# EAGLE schematic door_lock_v1.2 (EAGLE 9.6.0)

## Sheet 1 of 2
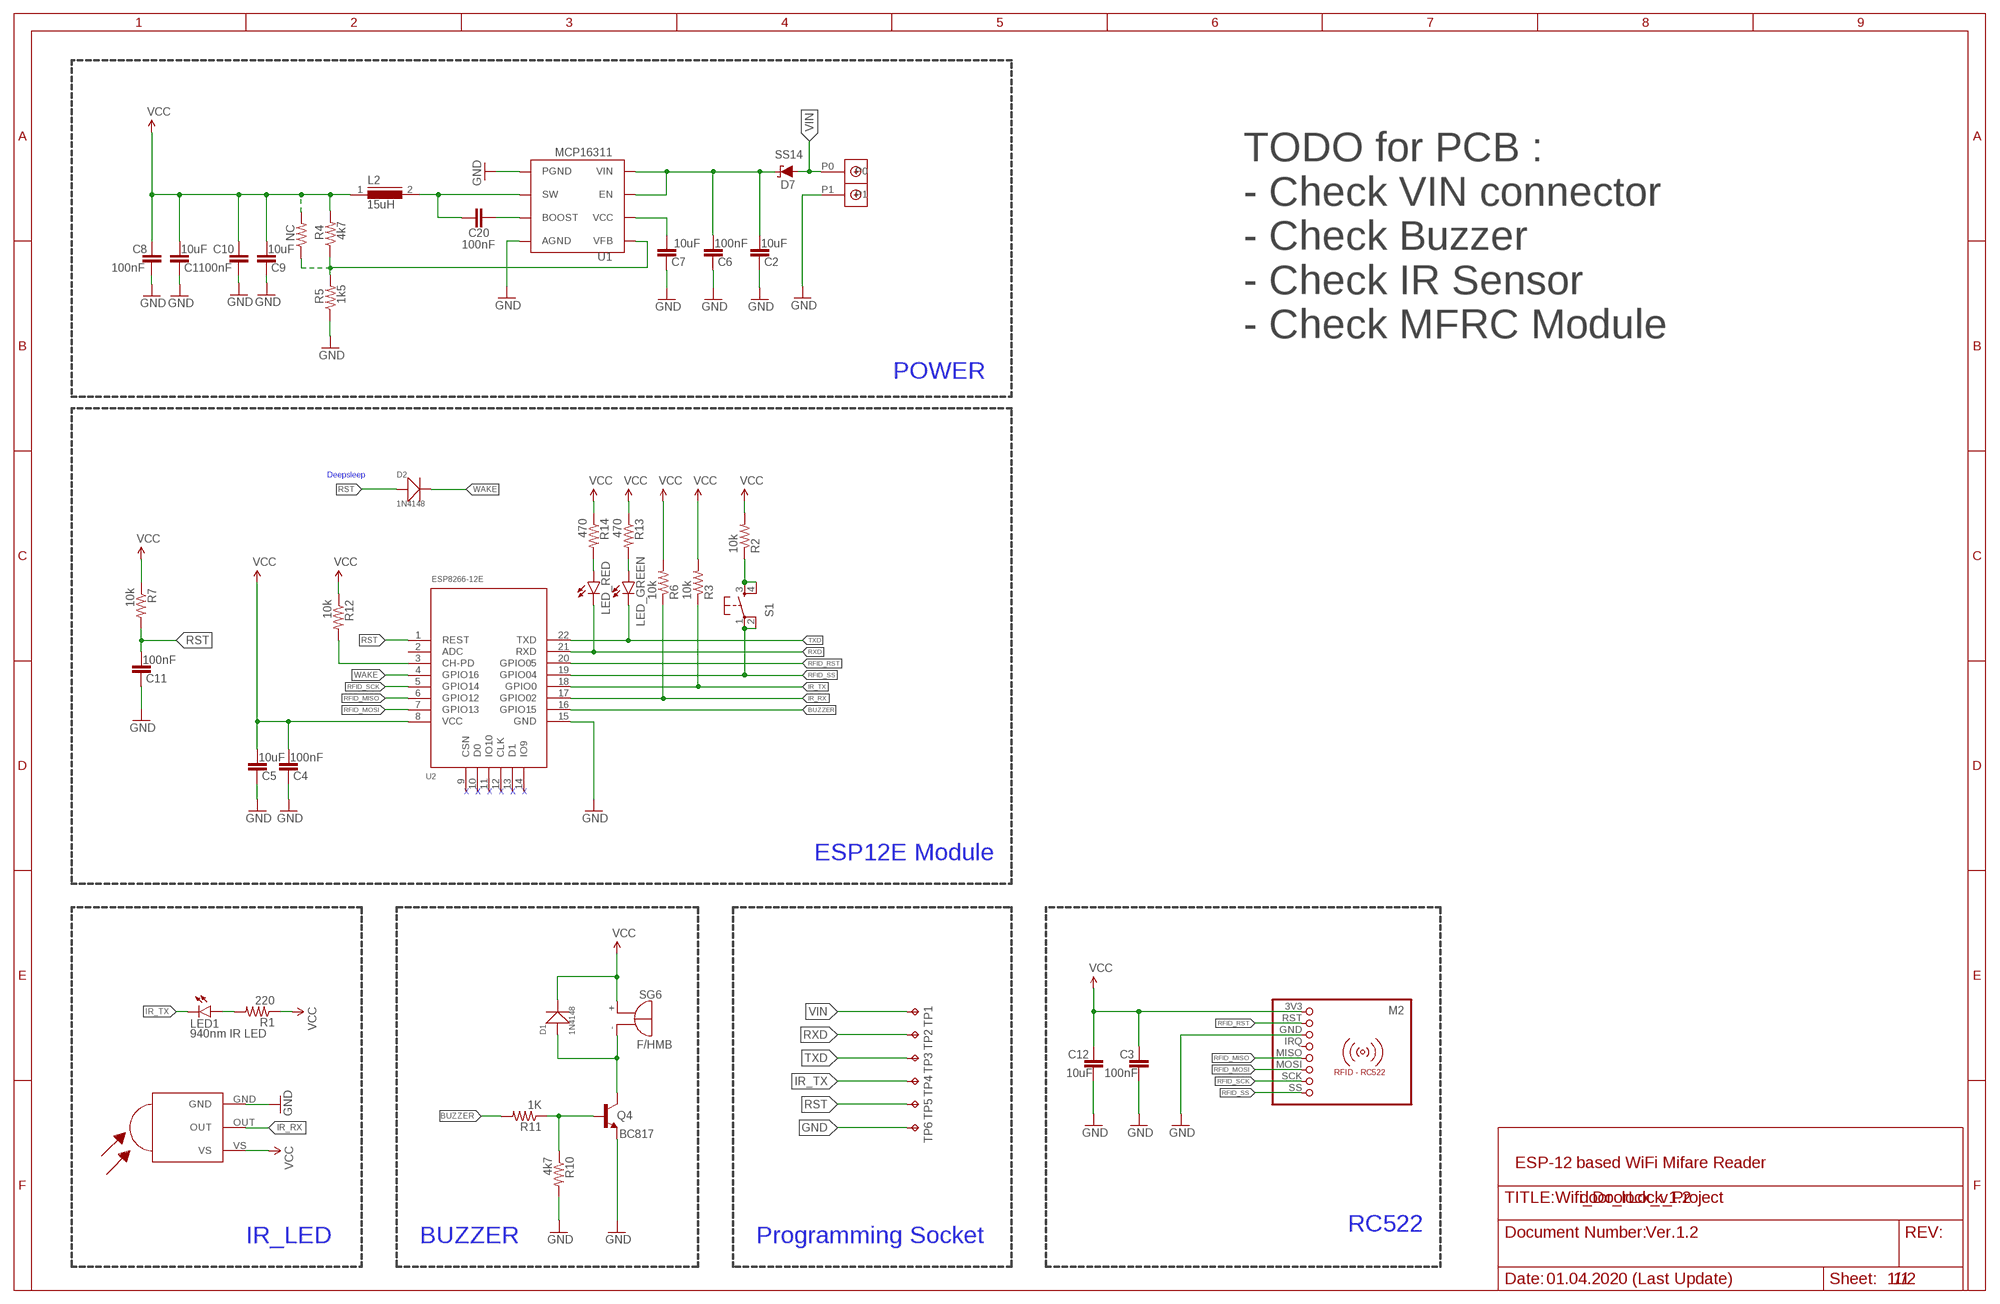
[diagram p0: schematic, sheet 1]

### Parts
C1  10uF  C-EUC0805  [C0805]
C2  10uF  C-EUC0805  [C0805]
C3  100nF  C-EUC0805  [C0805]
C4  100nF  C-EUC0805  [C0805]
C5  10uF  C-EUC0805  [C0805]
C6  100nF  C-EUC0805  [C0805]
C7  10uF  C-EUC0805  [C0805]
C8  100nF  C-EUC0805  [C0805]
C9  10uF  C-EUC0805  [C0805]
C10  100nF  C-EUC0805  [C0805]
C11  100nF  C-EUC0805  [C0805]
C12  10uF  C-EUC0805  [C0805]
C20  100nF  C-EUC0805  [C0805]
D1  1N4148  SMD-DIODE-SWITCH-1N4148(LL-34)  [LL-34]
D2  1N4148  SMD-DIODE-SWITCH-1N4148(LL-34)  [LL-34]
D7  SS14  DIODE-SCHOTTKY-SS14  [SMA-DIODE]
L2  15uH  DR74  [DR74]
LED1  940nm IR LED  LED3MM  [LED3MM]
LED_GREEN  LED3MM  [LED3MM]
LED_RED  LED3MM  [LED3MM]
M2  RFID-RC522  [RFID-RC522]
NC  SPARKFUN_RESISTOR0805-RES  [SPARKFUN_0805]
Q4  BC817  TRANSISTOR_BJT_NPN-SOT-23-BCE  [SOT-23]
R1  220  SPARKFUN_RESISTOR0805-RES  [SPARKFUN_0805]
R2  10k  SPARKFUN_RESISTOR0805-RES  [SPARKFUN_0805]
R3  10k  SPARKFUN_RESISTOR0805-RES  [SPARKFUN_0805]
R4  4k7  SPARKFUN_RESISTOR0805-RES  [SPARKFUN_0805]
R5  1k5  SPARKFUN_RESISTOR0805-RES  [SPARKFUN_0805]
R6  10k  SPARKFUN_RESISTOR0805-RES  [SPARKFUN_0805]
R7  10k  SPARKFUN_RESISTOR0805-RES  [SPARKFUN_0805]
R10  4k7  R-US_M0805  [M0805]
R11  1K  R-US_M0805  [M0805]
R12  10k  SPARKFUN_RESISTOR0805-RES  [SPARKFUN_0805]
R13  470  SPARKFUN_RESISTOR0805-RES  [SPARKFUN_0805]
R14  470  SPARKFUN_RESISTOR0805-RES  [SPARKFUN_0805]
S1  FLASH  TAC_SWITCHPTH  [TACTILE-PTH]
SG6  F/HMB  [F/HMB]
TP1  TPTP20SQ  [TP20SQ]
TP2  TPTP20SQ  [TP20SQ]
TP3  TPTP20SQ  [TP20SQ]
TP4  TPTP20SQ  [TP20SQ]
TP5  TPTP20SQ  [TP20SQ]
TP6  TPTP20SQ  [TP20SQ]
U1  MCP16311  [MSOP8]
U2  ESP8266-12E  MOUDLE-WIFI-ESP8266-12E/ESP-12E(22P-24X16MM)  [LGA22-2.0-24X16MM]
U$1  DBCONN-1X2  [DBCONN-1X2]
U$3  TSOP18  TSOP38238  [TSOP-382]

### Nets
BUZZER: R11.2 U2.16(GPIO15)
CH_PD: R12.2 U2.3(CH-PD)
GND: C1.1 C2.1 C3.2 C4.1 C5.1 C6.1 C7.1 C8.2 C9.1 C10.2 C11.1 C12.2 M2.GND Q4.3(E) R5.1 R10.2 TP6.TP U1.AGND U1.PGND U2.15(GND) U$1.P1 U$3.GND
IR_RX: R6.1 U2.17(GPIO02) U$3.OUT
IR_TX: LED1.K(C) R3.1 TP4.TP U2.18(GPIO0)
N$1: LED_RED.A R14.2
N$2: LED1.A R1.2
N$3: Q4.1(B) R10.1 R11.1
N$4: D1.A(+) Q4.2(C) SG6.-
N$6: R2.1 S1.3 S1.4
N$8: C20.2 L2.2 U1.SW
N$9: C20.1 U1.BOOST
N$11: C7.2 U1.VCC
N$12: C2.2 C6.2 D7.C U1.EN U1.VIN
N$13: LED_GREEN.A R13.2
N$14: NC.1 R4.1 R5.2 U1.VFB
RFID_MISO: M2.MISO U2.6(GPIO12)
RFID_MOSI: M2.MOSI U2.7(GPIO13)
RFID_RST: M2.RST U2.20(GPIO05)
RFID_SCK: M2.SCK U2.5(GPIO14)
RFID_SS: M2.SS S1.1 S1.2 U2.19(GPIO04)
RST: C11.2 D2.A(+) R7.2 TP5.TP U2.1(REST)
RXD: LED_RED.K(C) TP2.TP U2.21(RXD)
TXD: LED_GREEN.K(C) TP3.TP U2.22(TXD)
VCC: C1.2 C3.1 C4.2 C5.2 C8.1 C9.2 C10.1 C12.1 D1.C(-) L2.1 M2.3V3 NC.2 R1.1 R2.2 R3.2 R4.2 R6.2 R7.1 R12.1 R13.1 R14.1 SG6.+ U2.8(VCC) U$3.VS
VIN: D7.A TP1.TP U$1.P0
WAKE: D2.C(-) U2.4(GPIO16)
Unconnected: M2.IRQ U2.2(ADC) U2.9(CSN) U2.10(D0) U2.11(IO10) U2.12(CLK) U2.13(D1) U2.14(IO9)

### Notes on the sheet
- TODO for PCB :
  - Check VIN connector
  - Check Buzzer
  - Check IR Sensor
  - Check MFRC Module
- POWER
- Deepsleep
- X | X | X | X | X | X
- ESP12E Module
- ESP-12 based WiFi Mifare Reader
- Wifi_DoorLock_Project
- RC522
- Ver.1.2
- IR_LED | BUZZER | Programming Socket
- 01.04.2020 (Last Update) | 1/1

## Sheet 2 of 2

## Library data of the parts
C1-C12 C20 = rcl:C-EU: CAPACITOR, European symbol; SPICEPREFIX: C
D1 D2 = Seeed-Diode-2016:SMD-DIODE-SWITCH-1N4148(LL-34): 304040016; MPN: 1N4148
D7 = SparkFun-DiscreteSemi:DIODE-SCHOTTKY: Schottky diode A Schottky diode is a semiconductor diode which has a low forward voltage drop and a very fast switching action.; PROD_ID: DIO-08053; VALUE: 1A/40V/500mV
L2 = inductors:DR74: High Power Density, High Efficiency, Shielded Inductors Source: coiltronics_dr_series.pdf; SPICEPREFIX: L
LED1 LED_GREEN LED_RED = led:LED: LED OSRAM: - CHIPLED LG R971, LG N971, LY N971, LG Q971, LY Q971, LO R971, LY R971 LH N974, LH R974 LS Q976, LO Q976, LY Q976 LO Q996 - Hyper CHIPLED LW Q18S LB Q993, LB Q99A, LB R99A - SideLED LS A670, LO A670, LY A670, LG A670, LP A670 LB A673, LV A673, LT A673, LW A673 LH A674 LY A675 LS A676, LA A676, LO A676, LY A676, LW A676 LS A679, LY A679, LG A679 - Hyper Micro SIDELED® LS Y876, LA Y876, LO Y876, LY Y876 LT Y87S - SmartLED LW L88C, LW L88S LB L89C, LB L89S, LG L890 LS L89K, LO L89K, LY L89K LS L896, LA L896, LO L896, LY L896 - TOPLED LS T670, LO T670, LY T670, LG T670, LP T670 LSG T670, LSP T670, LSY T670, LOP T670, LYG T670 LG T671, LOG T671, LSG T671 LB T673, LV T673, LT T673, LW T673 LH T674 LS T676, LA T676, LO T676, LY T676, LB T676, LH T676, LSB T676, LW T676 LB T67C, LV T67C, LT T67C, LS T67K, LO T67K, LY T67K, LW E67C LS E67B, LA E67B, LO E67B, LY E67B, LB E67C, LV E67C, LT E67C LW T67C LS T679, LY T679, LG T679 LS T770, LO T770, LY T770, LG T770, LP T770 LB T773, LV T773, LT T773, LW T773 LH T774 LS E675, LA E675, LY E675, LS T675 LS T776, LA T776, LO T776, LY T776, LB T776 LHGB T686 LT T68C, LB T68C - Hyper Mini TOPLED® LB M676 - Mini TOPLED Santana® LG M470 LS M47K, LO M47K, LY M47K Source: http://www.osram.convergy.de LUXEON: - LUMILED® LXK2-PW12-R00, LXK2-PW12-S00, LXK2-PW14-U00, LXK2-PW14-V00 LXK2-PM12-R00, LXK2-PM12-S00, LXK2-PM14-U00 LXK2-PE12-Q00, LXK2-PE12-R00, LXK2-PE12-S00, LXK2-PE14-T00, LXK2-PE14-U00 LXK2-PB12-K00, LXK2-PB12-L00, LXK2-PB12-M00, LXK2-PB14-N00, LXK2-PB14-P00, LXK2-PB14-Q00 LXK2-PR12-L00, LXK2-PR12-M00, LXK2-PR14-Q00, LXK2-PR14-R00 LXK2-PD12-Q00, LXK2-PD12-R00, LXK2-PD12-S00 LXK2-PH12-R00, LXK2-PH12-S00 LXK2-PL12-P00, LXK2-PL12-Q00, LXK2-PL12-R00 Source: www.luxeon.com KINGBRIGHT: KA-3528ASYC Source: www.kingbright.com
M2 = mfrc522-module:RFID-RC522: RFID-RC522 MFRC-522 based breakout board
NC R1-R7 R12-R14 = antduino:SPARKFUN_RESISTOR: Resistor Basic schematic elements and footprints for 0603, 1206, and PTH resistors.
Q4 = dp_devices:TRANSISTOR_BJT_NPN: Most commonly used is SOT23-BEC
R10 R11 = adafruit:R-US_: RESISTOR, American symbol
S1 = SparkFun:TAC_SWITCH: Momentary Switch Button commonly used for reset or general input. Spark Fun Electronics SKU : COM-00097
SG6 = buzzer:F/HMB: BUZZER Source: Buerklin; OC_FARNELL: unknown; OC_NEWARK: unknown
TP1-TP6 = testpad:TP: Test pad
U1 = microchip:MCP16311
U2 = Seeed-OPL-Moudle:MOUDLE-WIFI-ESP8266-12E/ESP-12E(22P-24X16MM): 317060015; MPN: ESP8266-12E/ESP-12E; VALUE: ESP8266-12E/ESP-12E
U$1 = Terminal Block Connector:DBCONN-1X2
U$3 = TSOP38238:TSOP38238: 38 kHz 45 m 2.5-5.5 V Through Hole IR Receiver Module for Remote Control System; DESCRIPTION: Remote Receiver Sensor, 38.0kHz 45m Through Hole; DIGI-KEY_PART_NUMBER: 751-1227-ND; DIGI-KEY_PURCHASE_URL: https://www.digikey.com/product-detail/en/vishay-semiconductor-opto-division/TSOP38238/751-1227-ND/1681362?utm_source=snapeda&utm_medium=aggregator&utm_campaign=symbol; MF: Vishay; MP: TSOP38238; PACKAGE: None